# EasyEDA Pro project AS200 Mega2560电源板.eprj, board AS200Mega2560电源板-SYN-ZF
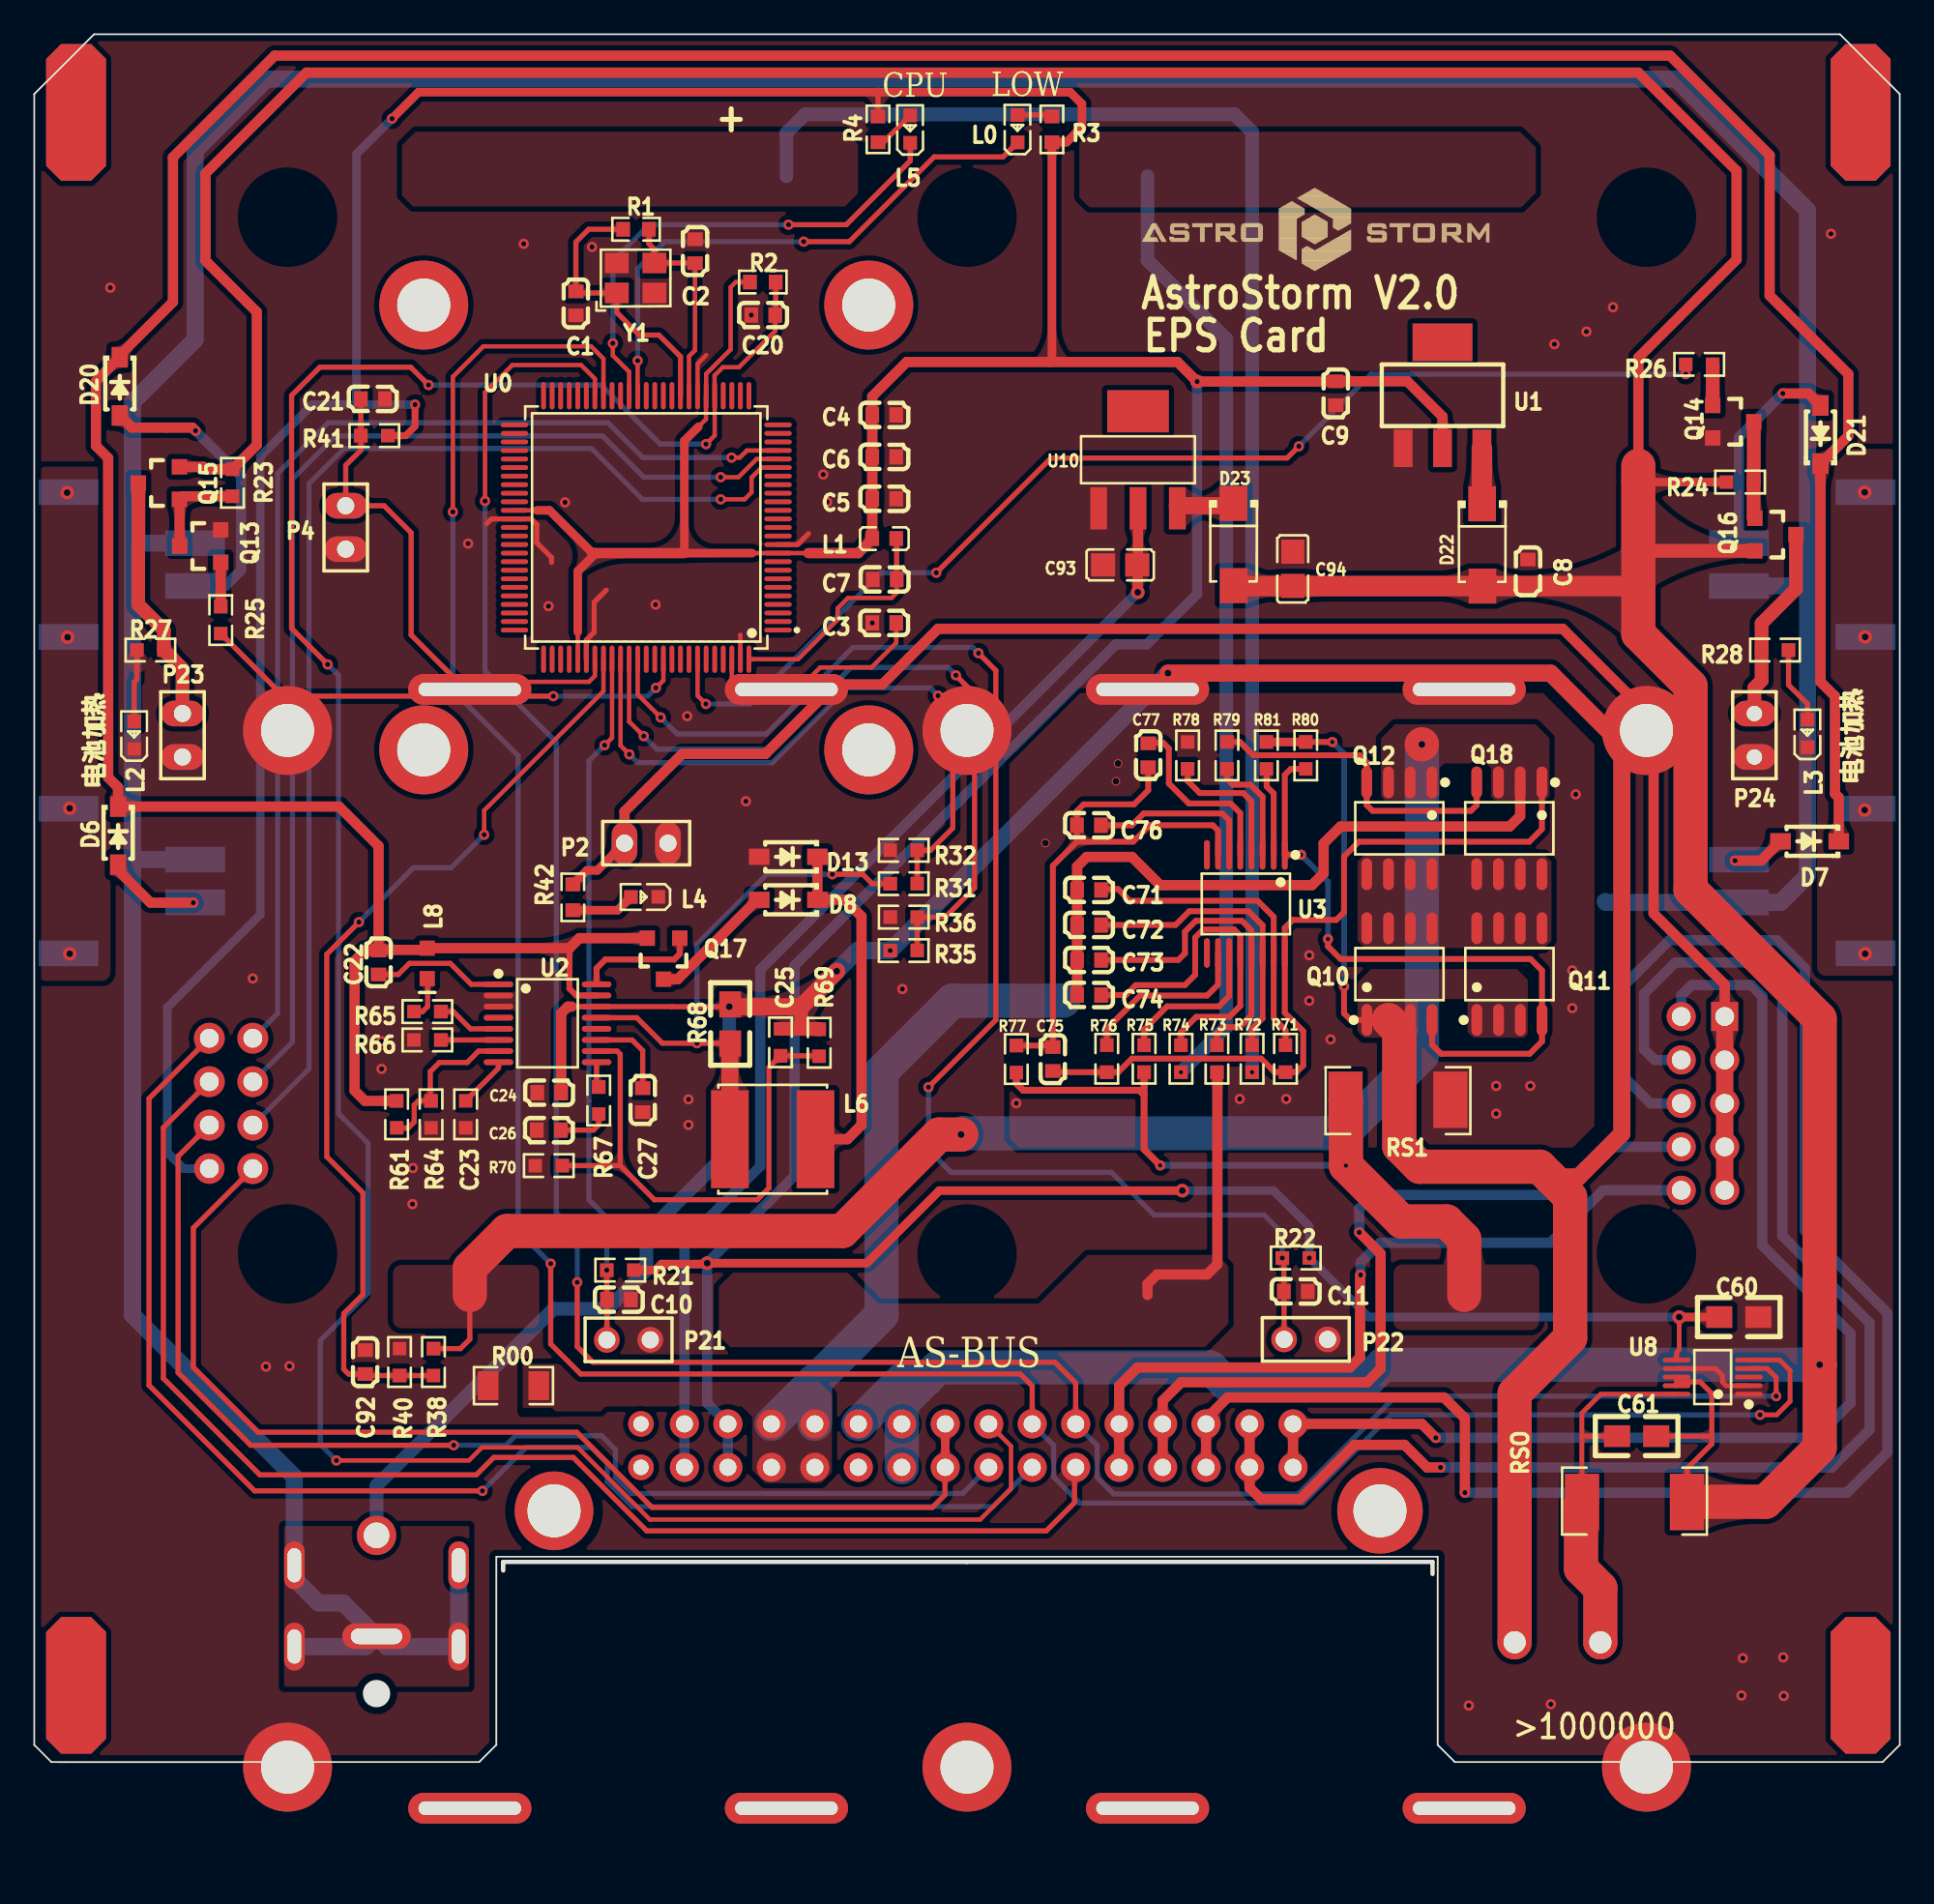
[diagram p1: board, top side]
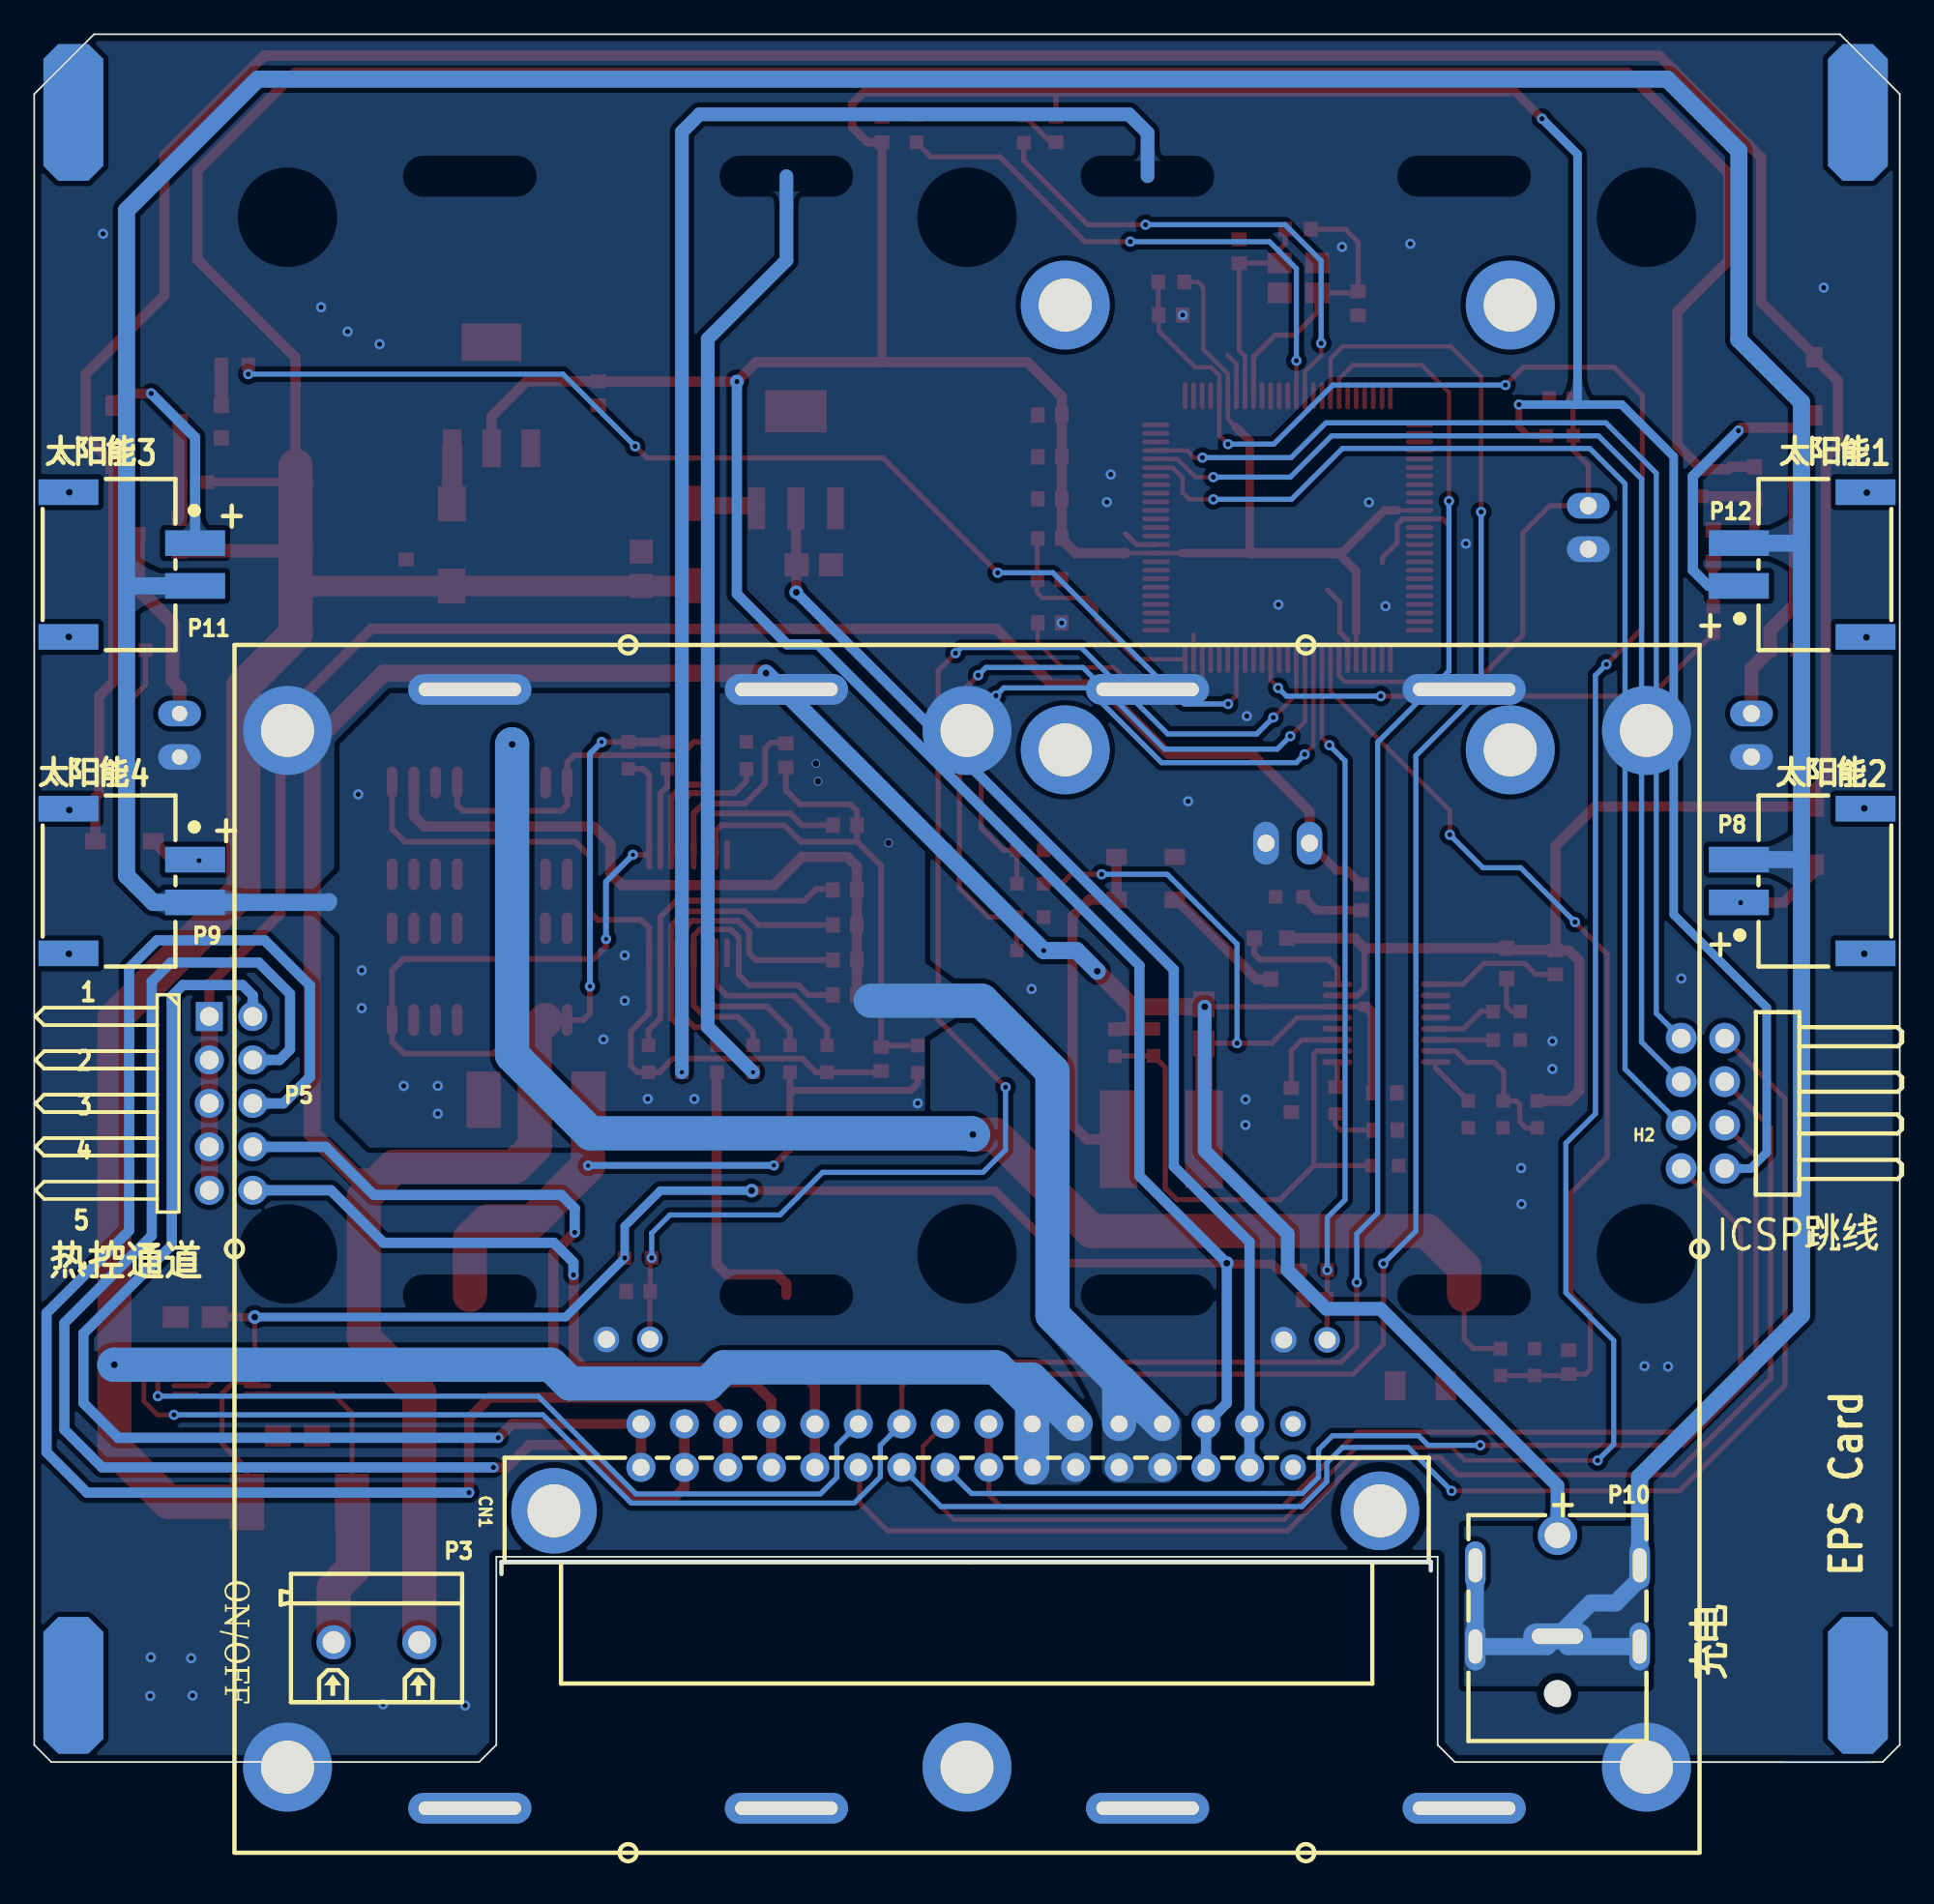
[diagram p2: board, bottom side, seen from below]

Outline 109 x 101 mm; copper layers: Top Layer, Bottom Layer. Coordinates in mm from the lower left corner of the outline.
Outline path: circle c30.35,14.71 r1.4 ; circle c78.65,14.71 r1.4 ; 0,1.01 0,97.5 3.5,101 105.5,101 109,97.5 109,1.01 108,0.01 83,0.01 82,1.01 82,12.01 27,12.01 27,1.01 26,0.01 1.85,0 1,0.01 0,1.01
Stack: Top Layer 0.0356mm / Dielectric 1 0.32mm FR-4 er 4.8 / Bottom Layer 0.0356mm

## Design rules (mm)
template: 用户自定义配置
spacing PClr1 (default): track to track 0.102, other pairs 0.102 to 0.3
track width Width (default): min 0.254, default 0.635, max 3
differential pair DiffPairsRouting (default): width min 0.381, default 0.381, max 0.381; gap min 0.254, default 0.254
via RoutingVias (default): diameter min 0.5, default 1, max 3; hole min 0.254, default 0.305, max 2.8
via viaSize1: diameter min 0.5, default 0.61, max 10; hole min 0.3, default 0.305, max 6.299

## Placement (name value [footprint] x y rotation side)
BATTERY  18650  [18650PACK]  54.5 60.01 0 bottom
C1  20pF  [C0603]  31.65 85.27 90 top
C2  20pF  [C0603]  38.61 88.32 270 top
C3  100nF  [C0603]  49.67 66.59 0 top
C4  100nF  [C0603]  49.66 78.75 180 top
C5  100nF  [C0603]  49.66 73.85 180 top
C6  100nF  [C0603]  49.66 76.3 180 top
C7  100nF  [C0603]  49.69 69.13 0 top
C8  10uF  [C0603]  87.27 69.6 270 top
C9  10uF  [C0603]  76.05 80.02 90 top
C10  10uF  [C0603]  34.16 27.03 0 top
C11  10uF  [C0603]  73.71 27.51 0 top
C20  100nF  [C0603]  42.6 84.59 0 top
C21  10uF  [C0603]  19.79 79.69 0 top
C22  100nF  [C0603]  20.12 46.74 270 top
C23  470PF  [0603]  25.21 37.08 90 top
C24  10uF  [C0603]  30.09 39.13 0 top
C25  20pf  [0603]  43.6 41.29 90 top
C26  220nF  [C0603]  30.06 36.94 180 top
C27  100nF  [C0603]  35.55 38.7 270 top
C60  100nF  [0805]  100.74 26.02 180 top
C61  100nF  [0805]  94.77 19.06 180 top
C71  100nF  [C0603]  61.64 50.98 0 top
C72  100nF  [C0603]  61.64 48.94 0 top
C73  100nF  [C0603]  61.64 46.89 0 top
C74  100nF  [C0603]  61.64 44.84 0 top
C75  2.2uF  [C0603]  59.52 41.1 90 top
C76  100nF  [C0603]  61.62 54.76 180 top
C77  100nF  [C0603]  65.09 58.85 270 top
C92  100nF  [C0603]  19.34 23.39 90 top
C93  10uf  [C0805]  63.45 69.98 0 top
C94  10uf  [C0805]  73.53 69.75 270 top
CN1  2.0-2*20P弯简牛  [CONN-TH_32P-P2.54_9001-35321C00A]  54.5 18.5 180 bottom
D6  B5819W SL  [SOD-123_L2.7-W1.6-LS3.7-RD-1]  4.9 54.16 270 top
D7  B5819W SL  [SOD-123_L2.7-W1.6-LS3.7-RD-1]  103.73 53.83 180 top
D8  B5819W SL  [SOD-123_L2.7-W1.6-LS3.7-RD-1]  44.06 50.41 180 top
D13  B5819W SL  [SOD-123_L2.7-W1.6-LS3.7-RD-1]  44.06 52.92 180 top
D20  B5819W SL  [SOD-123_L2.7-W1.6-LS3.7-RD-1]  5 80.42 270 top
D21  B5819W SL  [SOD-123_L2.7-W1.6-LS3.7-RD-1]  104.37 77.6 90 top
D22  SS54  [SMA_L4.3-W2.6-LS5.0-RD]  84.61 71.15 270 top
D23  SS54  [SMA_L4.3-W2.6-LS5.0-RD]  70.08 71.18 270 top
H2  PZ254R-12-8P  [HDR-TH_8P-P2.54-H-M-R2-C4-S2.54]  11.5 38.51 90 bottom
L0  MHT192WDT-ICE  [LED0603-RD]  57.46 95.48 90 top
L1  10uH  [L0603]  49.66 71.53 180 top
L2  NCD0603R1  [LED0603-RD_RED]  5.84 60.03 90 top
L3  NCD0603R1  [LED0603-RD_RED]  103.61 60.13 90 top
L4  NCD0603R1  [LED0603-RD_RED]  35.66 50.58 180 top
L5  NCD0603G1  [LED0603-RD]  51.18 95.46 90 top
L6  33uH  [IND-SMD_L6.0-W6.0]  43.15 36.41 180 top
L8  NCD0603R1  [LED 0603]  22.96 47.58 90 top
NOREF  -  [Pad_ie68]  106.71 4.49 180 top
NOREF#2  -  [Pad_ie73]  2.45 4.49 180 top
NOREF#3  -  [Pad_e44529]  48.76 59.17 0 top
NOREF#4  -  [Pad_ie72]  2.45 96.43 180 top
NOREF#5  -  [Pad_e44531]  48.76 85.17 0 top
NOREF#6  -  [Pad_e44527]  22.76 59.17 0 top
NOREF#7  -  [Pad_e44522]  22.76 85.17 0 top
NOREF#8  -  [Pad_ie71]  106.71 96.43 180 top
P2  加热片  [hdr1x2]  37.03 53.72 180 top
P3  WJ2EDGRC-5.08-2P  [CONN-TH_2P-P5.00_WJ301V-5.00-2P]  89 7.01 180 bottom
P4  热敏  [hdr1x2]  18.2 70.9 90 top
P5  2.54-2*5P弯针  [HDR-TH_10P-P2.54-H-M-R2-C5-S2.54-W12.9]  97.5 38.51 270 bottom
P8  S2B-PH-SM4-TB(LF)(SN)  [CONN-SMD_2P-P2.54_MEGASTAR_ZX-XH2.54-2PWT]  5.7 51.51 90 bottom
P9  S2B-PH-SM4-TB(LF)(SN)  [CONN-SMD_2P-P2.54_MEGASTAR_ZX-XH2.54-2PWT]  103.3 51.51 270 bottom
P10  WJ15EDGRC-3.81-2P  [DC-IN-TH_DC-053D-25A-1]  20 10.01 0 bottom
P11  S2B-PH-SM4-TB(LF)(SN)  [CONN-SMD_2P-P2.54_MEGASTAR_ZX-XH2.54-2PWT]  103.3 70.01 270 bottom
P12  S2B-PH-SM4-TB(LF)(SN)  [CONN-SMD_2P-P2.54_MEGASTAR_ZX-XH2.54-2PWT]  5.7 70.01 90 bottom
P21  热敏  [HDR1X2]  36 24.68 180 top
P22  热敏  [HDR1X2]  75.57 24.71 180 top
P23  加热片  [hdr1x2]  8.66 58.76 90 top
P24  加热片  [hdr1x2#2]  100.51 58.76 90 top
Q10  AO4407  [SOP-8_L4.9-W3.9-P1.27-LS6.0-BL-1]  79.77 46.06 0 top
Q11  AO4407  [SOP-8_L4.9-W3.9-P1.27-LS6.0-BL-1]  86.19 46.06 0 top
Q12  AO4407  [SOP-8_L4.9-W3.9-P1.27-LS6.0-BL-1]  79.76 54.59 180 top
Q13  S8050  [SOT23]  10.9 70.13 0 top
Q14  S8050  [SOT23]  98.07 79.3 180 top
Q15  SI2301-ZE  [SOT23]  8.48 73.82 0 top
Q16  SI2301-ZE  [SOT23]  100.53 72.71 180 top
Q17  SI2301-ZE  [SOT23]  37.72 48.16 90 top
Q18  AO4407  [SOP-8_L4.9-W3.9-P1.27-LS6.0-BL-1]  86.19 54.59 180 top
R00  0Ω  [R1206]  28 22.01 180 top
R1  1MΩ  [R0603]  35.16 89.6 0 top
R2  10kΩ  [R0603]  42.57 86.52 180 top
R3  6.8K  [R0603]  59.46 95.44 270 top
R4  6.8K  [R0603]  49.3 95.44 90 top
R21  10kΩ  [0603]  33.45 28.76 0 top
R22  10kΩ  [0603]  72.92 29.47 0 top
R23  20K  [0603]  11.58 74 90 top
R24  20K  [0603]  100.46 74.82 180 top
R25  10kΩ  [0603]  10.9 67.54 270 top
R26  10kΩ  [0603]  98.07 81.71 180 top
R27  10kΩ  [0603]  6 65.01 0 top
R28  10kΩ  [0603]  102.5 65.01 180 top
R31  30kΩ  [0603]  50.02 51.35 0 top
R32  10kΩ  [0603]  51.59 53.3 180 top
R35  30kΩ  [0603]  50.02 47.44 0 top
R36  10kΩ  [0603]  50.02 49.39 0 top
R38  30kΩ  [0603]  23.33 24.17 270 top
R40  10kΩ  [0603]  21.34 22.6 90 top
R41  10kΩ  [0603]  19.08 77.54 0 top
R42  6.8K  [R0603]  31.47 50.55 90 top
R61  33K  [0603]  21.17 38.65 270 top
R64  2.2K  [0603]  23.18 38.65 270 top
R65  10kΩ  [0603]  23.76 43.87 180 top
R66  10kΩ  [0603]  23.76 42.21 180 top
R67  120R  [0603]  32.98 39.46 270 top
R68  0.33R  [0805]  40.66 42.01 90 top
R69  90kΩ  [0603]  45.86 42.84 270 top
R70  15kΩ  [0603]  30.85 34.87 180 top
R71  1K  [0603]  73.11 40.33 90 top
R72  1K  [0603]  71.16 40.33 90 top
R73  1K  [0603]  69.1 40.33 90 top
R74  1K  [0603]  67 40.33 90 top
R75  1K  [0603]  64.85 40.33 90 top
R76  1K  [0603]  62.67 40.33 90 top
R77  51R  [0603]  57.38 41.89 270 top
R78  1K  [0603]  67.39 58.06 90 top
R79  5.1K  [0603]  69.69 58.06 90 top
R80  1M  [0603]  74.29 59.63 270 top
R81  5.1K  [0603]  71.99 59.63 270 top
RS1  0.02R  [RES-SMD_L6.4-W3.2-R2512]  79.68 38.72 180 top
RSO  10mΩ  [RES-SMD_L6.4-W3.2-R2512]  93.5 15.21 0 top
U0  ATMEGA2560-16AU  [TQFP-100_L14.0-W14.0-P0.50-LS16.0-BL]  35.76 72.17 90 top
U1  AMS1117-5.0  [SOT-223_L6.7-W3.5-P2.30-BR]  82.28 79.9 270 top
U2  CN3722  [TSSOP-16_L5.0-W4.4-P0.65-LS6.4-BL]  29.99 43.19 270 top
U3  FM8254AAV  [TSSOP-16_L5.0-W4.4-P0.65-LS6.4-BL]  70.79 50.17 180 top
U8  INA226AIDGSR  [MSOP-10_L3.0-W3.0-P0.50-LS5.0-BL]  98.07 22.51 90 top
U10  AMS1117-3.3V  [SOT-223-4_L6.5-W3.5-P2.30-LS7.0-TR]  64.49 76.13 0 top
Y1  16MHz  [OSC-SMD_4P-L3.2-W2.5-BL]  35.14 86.76 0 top

## Footprints (pads in the part's own frame, mm; a bottom-side part is the same pattern mirrored in y, then rotated)
0603
  rect 0.8x0.8 smd: 1(0,0)
  rect 0.787x0.787 smd: 2(1.575,0)
0805
  rect 1.524x1.27 smd: 1(0,0) 2(2.286,0)
18650PACK
  oval 7.2x1.8 hole 6x0.8: 1(-29.05,-2.7) 2(-10.55,-2.7) 3(10.55,-2.7) 4(29.05,-2.7) 5(-29.05,62.7) 6(-10.55,62.7) 7(10.55,62.7) 8(29.05,62.7)
  round 5.2 hole 3.1: 9(-39.7,60.3) 10(39.7,60.3) 11(0,60.3) 12(-39.7,-0.3) 13(0,-0.3) 14(39.7,-0.3)
C0603
  rect 0.8x0.9 smd: 1(-0.7,0) 2(0.7,0)
C0805
  rect 1.41x1.35 smd: 1(-1,0) 2(1,0)
CONN-SMD_2P-P2.54_MEGASTAR_ZX-XH2.54-2PWT
  rect 1.5x3.5 smd: 1(-1.25,3.7) 2(1.25,3.7) 3(-4.23,-3.7) 4(4.23,-3.7)
CONN-TH_2P-P5.00_WJ301V-5.00-2P
  round 2 hole 1.3: 1(-2.505,0) 2(2.505,0)
CONN-TH_32P-P2.54_9001-35321C00A
  round 5 hole 3.1: 1(-24.13,-3.81)
  round 4.6 hole 3.1: 1(24.13,-3.81)
  round 1.5 hole 0.9: a1(19.05,-1.27) b1(19.05,1.27)
  round 1.7 hole 1: a2(16.51,-1.27) a3(13.97,-1.27) a4(11.43,-1.27) a5(8.89,-1.27) a6(6.35,-1.27) a7(3.81,-1.27) a8(1.27,-1.27) a9(-1.27,-1.27) a10(-3.81,-1.27) a11(-6.35,-1.27) a12(-8.89,-1.27) a13(-11.43,-1.27) a14(-13.97,-1.27) a15(-16.51,-1.27) a16(-19.05,-1.27) b2(16.51,1.27) b3(13.97,1.27) b4(11.43,1.27) b5(8.89,1.27) b6(6.35,1.27) b7(3.81,1.27) b8(1.27,1.27) b9(-1.27,1.27) b10(-3.81,1.27) b11(-6.35,1.27) b12(-8.89,1.27) b13(-11.43,1.27) b14(-13.97,1.27) b15(-16.51,1.27) b16(-19.05,1.27)
DC-IN-TH_DC-053D-25A-1
  round 2.3 hole 1.5: 1(0,-3.25)
  oval 4x1.5 hole 3x0.914: 2(0,2.65)
  oval 1.2x2.8 hole 0.8x2: 3(-4.8,-1.5) 3(-4.8,3.25) 3(4.8,-1.5) 3(4.8,3.25)
hdr1x2
  oval 1.5x2.5 hole 1: 1(0,0) 2(2.54,0)
hdr1x2#2
  oval 1.5x2.5 hole 0.9: 1(0,0) 2(2.54,0)
HDR1X2
  oval 1.5x1.5 hole 1: 1(0,0) 2(2.54,0)
HDR-TH_8P-P2.54-H-M-R2-C4-S2.54
  round 1.778 hole 1.1: 1(-3.81,-1.27)
  round 1.8 hole 1.1: 2(-3.81,1.27) 3(-1.27,-1.27) 4(-1.27,1.27) 5(1.27,-1.27) 6(1.27,1.27) 7(3.81,-1.27) 8(3.81,1.27)
HDR-TH_10P-P2.54-H-M-R2-C5-S2.54-W12.9
  rect 1.7x1.575 hole 1.1: 1(-5.08,-1.27)
  round 1.7 hole 1.1: 2(-5.08,1.27) 3(-2.54,-1.27) 4(-2.54,1.27) 5(0,-1.27) 6(0,1.27) 7(2.54,-1.27) 8(2.54,1.27) 9(5.08,-1.27) 10(5.08,1.27)
IND-SMD_L6.0-W6.0
  rect 2.2x5.72 smd: 1(-2.5,0) 2(2.5,0)
L0603
  rect 0.8x0.864 smd: 1(-0.7,0) 2(0.7,0)
LED0603-RD
  rect 0.8x0.8 smd: 1(-0.799,0) 2(0.799,0)
LED0603-RD_RED
  rect 0.8x0.8 smd: 1(-0.799,-0.004) 2(0.799,0.004)
LED 0603
  rect 0.889x0.889 smd: 1(0,0) 2(-1.778,0)
MSOP-10_L3.0-W3.0-P0.50-LS5.0-BL
  oval 0.28x1.62 smd: 1(-1,-2.11) 2(-0.5,-2.11) 3(0,-2.11) 4(0.5,-2.11) 5(1,-2.11) 6(1,2.11) 7(0.5,2.11) 8(0,2.11) 9(-0.5,2.11) 10(-1,2.11)
OSC-SMD_4P-L3.2-W2.5-BL
  rect 1.4x1.2 smd: 1(-1.1,-0.875) 2(1.1,-0.875) 3(1.1,0.875) 4(-1.1,0.875)
Pad_e44522
  round 5.2 hole 3.1: 101(0,0)
Pad_e44527
  round 5.2 hole 3.1: 1(0,0)
Pad_e44529
  round 5.2 hole 3.1: 1(0,0)
Pad_e44531
  round 5.2 hole 3.1: 1(0,0)
Pad_ie68
  custom 3.5x8 hole 0.305: 1(0,0)
Pad_ie71
  custom 3.5x8 hole 0.305: 0(0,0)
Pad_ie72
  custom 3.5x8 hole 0.305: 3(0,0)
Pad_ie73
  custom 3.5x8 hole 0.305: 2(0,0)
R0603
  rect 0.806x0.864 smd: 1(-0.753,0) 2(0.753,0)
R1206
  rect 1.208x1.701 smd: 1(-1.479,0) 2(1.479,0)
RES-SMD_L6.4-W3.2-R2512
  rect 2x3.3 smd: 1(-3.067,0) 2(3.067,0)
SMA_L4.3-W2.6-LS5.0-RD
  rect 2.046x1.62 smd: 1(-2.404,-0.009) 2(2.404,0.009)
SOD-123_L2.7-W1.6-LS3.7-RD-1
  rect 1.2x0.95 smd: 1(-1.7,0) 2(1.7,0)
SOP-8_L4.9-W3.9-P1.27-LS6.0-BL-1
  oval 0.63x1.865 smd: 1(-1.905,-2.683) 2(-0.635,-2.683) 3(0.635,-2.683) 4(1.905,-2.683) 5(1.905,2.683) 6(0.635,2.683) 7(-0.635,2.683) 8(-1.905,2.683)
SOT23
  rect 0.9x0.9 smd: 1(0,0) 2(0,1.9) 3(-2.4,0.95)
SOT-223-4_L6.5-W3.5-P2.30-LS7.0-TR
  rect 0.98x2.47 smd: 1(-2.3,-2.835) 2(0,-2.835) 3(2.3,-2.835)
  rect 3.6x2.47 smd: 4(0,2.835)
SOT-223_L6.7-W3.5-P2.30-BR
  rect 2.2x1.1 smd: 1(3.099,-2.3) 2(3.099,0) 3(3.099,2.3)
  rect 2.2x3.5 smd: 4(-3.099,0)
TQFP-100_L14.0-W14.0-P0.50-LS16.0-BL
  oval 0.28x1.6 smd: 1(-6,-7.7) 2(-5.5,-7.7) 3(-5,-7.7) 4(-4.5,-7.7) 5(-4,-7.7) 6(-3.5,-7.7) 7(-3,-7.7) 8(-2.5,-7.7) 9(-2,-7.7) 10(-1.5,-7.7) 11(-1,-7.7) 12(-0.5,-7.7) 13(0,-7.7) 14(0.5,-7.7) 15(1,-7.7) 16(1.5,-7.7) 17(2,-7.7) 18(2.5,-7.7) 19(3,-7.7) 20(3.5,-7.7) 21(4,-7.7) 22(4.5,-7.7) 23(5,-7.7) 24(5.5,-7.7) 25(6,-7.7) 51(6,7.7) 52(5.5,7.7) 53(5,7.7) 54(4.5,7.7) 55(4,7.7) 56(3.5,7.7) 57(3,7.7) 58(2.5,7.7) 59(2,7.7) 60(1.5,7.7) 61(1,7.7) 62(0.5,7.7) 63(0,7.7) 64(-0.5,7.7) 65(-1,7.7) 66(-1.5,7.7) 67(-2,7.7) 68(-2.5,7.7) 69(-3,7.7) 70(-3.5,7.7) 71(-4,7.7) 72(-4.5,7.7) 73(-5,7.7) 74(-5.5,7.7) 75(-6,7.7)
  oval 1.6x0.28 smd: 26(7.7,-6) 27(7.7,-5.5) 28(7.7,-5) 29(7.7,-4.5) 30(7.7,-4) 31(7.7,-3.5) 32(7.7,-3) 33(7.7,-2.5) 34(7.7,-2) 35(7.7,-1.5) 36(7.7,-1) 37(7.7,-0.5) 38(7.7,0) 39(7.7,0.5) 40(7.7,1) 41(7.7,1.5) 42(7.7,2) 43(7.7,2.5) 44(7.7,3) 45(7.7,3.5) 46(7.7,4) 47(7.7,4.5) 48(7.7,5) 49(7.7,5.5) 50(7.7,6) 76(-7.7,6) 77(-7.7,5.5) 78(-7.7,5) 79(-7.7,4.5) 80(-7.7,4) 81(-7.7,3.5) 82(-7.7,3) 83(-7.7,2.5) 84(-7.7,2) 85(-7.7,1.5) 86(-7.7,1) 87(-7.7,0.5) 88(-7.7,0) 89(-7.7,-0.5) 90(-7.7,-1) 91(-7.7,-1.5) 92(-7.7,-2) 93(-7.7,-2.5) 94(-7.7,-3) 95(-7.7,-3.5) 96(-7.7,-4) 97(-7.7,-4.5) 98(-7.7,-5) 99(-7.7,-5.5) 100(-7.7,-6)
TSSOP-16_L5.0-W4.4-P0.65-LS6.4-BL
  oval 0.343x1.732 smd: 1(-2.275,-2.866) 2(-1.625,-2.866) 3(-0.975,-2.866) 4(-0.325,-2.866) 5(0.325,-2.866) 6(0.975,-2.866) 7(1.625,-2.866) 8(2.275,-2.866) 9(2.275,2.866) 10(1.625,2.866) 11(0.975,2.866) 12(0.325,2.866) 13(-0.325,2.866) 14(-0.975,2.866) 15(-1.625,2.866) 16(-2.275,2.866)

## Nets
3V3BUS: C93.2 CN1.a2 CN1.b2 U10.2
+5V: C4.2 C5.2 C6.2 C9.2 C60.2 CN1.a3 CN1.b3 H2.1 L1.2 R2.2 R3.2 R4.2 R21.2 R22.2 R41.2 U0.10 U0.31 U0.61 U0.80 U1.2 U8.6
AGND: CN1.a4 CN1.a5 CN1.b4 CN1.b5 P8.2 P9.2 P10.2 P10.3 P11.2 P12.2 R00.1 R78.2 RS1.1
V12V: C8.2 C61.1 C94.2 CN1.a6 CN1.a7 CN1.b6 CN1.b7 D22.2 D23.2 Q15.2 Q16.2 R23.2 R24.2 RSO.2 U8.8 U8.9
VIN+: C61.2 P3.1 RSO.1 U8.10
89UASDIF: D23.1 U10.3
ADC8: U0.89
ADC9: U0.88
ADC10: C11.1 P22.2 R22.1 U0.87
ADC11: R35.2 R36.2 U0.86
ADC12: R31.2 R32.1 U0.85
ADC13: C10.1 P21.2 R21.1 U0.84
ADC14: C92.1 R38.2 R40.1 U0.83
ADC15: C21.1 P4.2 R41.1 U0.82
AREF: C3.2 U0.98
B1: BATTERY.3 BATTERY.4 R74.1
B2: BATTERY.6 BATTERY.7 R73.1
B3: BATTERY.1 BATTERY.2 R72.1
B+: BATTERY.5 C71.1 C72.1 C73.1 C74.1 C75.1 Q12.1 Q12.2 Q12.3 Q18.1 Q18.2 Q18.3 R38.1 R71.1 R76.1 U3.16
B-: BATTERY.8 R75.1 R77.2 RS1.2
ICSP5V: CN1.a8 CN1.b8 H2.2
LEDB: L5.1 U0.40
LEDR: L0.1 U0.39
N1: P8.3 P8.4 P12.3 P12.4
N2: P9.3 P9.4 P11.3 P11.4
NETC7_2: C7.2 L1.1 U0.100
NETC22_2: C22.2 U2.1
NETC23_2: C23.2 U2.8
NETC25_1: C25.1 R69.2 R70.1 U2.10
NETC26_1: C26.1 R67.2
NETC27_1: C27.1 U2.11
NETC75_2: C75.2 C76.2 C77.2 R77.1 U3.7
NETC76_1: C76.1 U3.6
NETC77_1: C77.1 U3.5
NETD6_2: D6.2 P8.1
NETD7_2: D7.2 P9.1
NETD8_1: D8.1 D13.1 L6.1
NETD8_2: D8.2 Q17.3
NETD20_2: D20.2 P12.1
NETD21_2: D21.2 P11.1
NETL0_1: L0.2 R3.1
NETL2_1: L2.2 R27.1
NETL3_1: L3.2 R28.1
NETL4_1: L4.2 R42.1
NETL5_1: L5.2 R4.1
NETL8_2: L8.2 R65.2
NETP2_2: P2.2 P5.1 P5.3 P5.5 P5.7 P5.9 R42.2
NETP23_2: P23.2 Q15.3 R27.2
NETP24_2: P24.2 Q16.3 R28.2
NETQ10_4: Q10.4 Q11.4 R80.2 U3.1
NETQ10_5: Q10.5 Q10.6 Q10.7 Q10.8 Q11.5 Q11.6 Q11.7 Q11.8 Q12.5 Q12.6 Q12.7 Q12.8 Q18.5 Q18.6 Q18.7 Q18.8
NETQ12_4: Q12.4 Q18.4 R79.2
NETQ13_1: Q13.1 R25.1
NETQ13_3: Q13.3 Q15.1 R23.1
NETQ14_1: Q14.1 R26.1
NETQ14_3: Q14.3 Q16.1 R24.1
NETQ17_1: Q17.1 U2.16
NETR61_2: R61.2 R64.1 U2.7
NETR65_1: R65.1 U2.5
NETR66_1: R66.1 U2.6
NETR67_1: R67.1 U2.9
NETR75_2: R75.2 U3.11
NETR76_2: R76.2 U3.10
NETR78_1: R78.1 U3.4
NETR79_1: R79.1 U3.3
NETR81_2: R81.2 U3.2
P+: C24.2 C25.2 P3.2 P10.1 Q10.1 Q10.2 Q10.3 Q11.1 Q11.2 Q11.3 R35.1 R68.2 R69.1 R80.1 R81.1 U2.14
P-: C1.1 C2.1 C3.1 C4.1 C5.1 C6.1 C7.1 C8.1 C9.1 C10.2 C11.2 C20.1 C21.2 C23.1 C24.1 C26.2 C27.2 C60.1 C92.2 C93.1 C94.1 D13.2 L2.1 L3.1 L4.1 P2.1 P4.1 P21.1 P22.1 P23.1 P24.1 Q13.2 Q14.2 R00.2 R32.2 R36.1 R40.2 R64.2 R66.2 R70.2 U0.11 U0.32 U0.62 U0.81 U0.99 U1.1 U2.2 U2.3 U8.1 U8.2 U8.7 U10.1 Y1.2 Y1.4
PB1: H2.4 U0.20
PB1PC: CN1.a9 H2.3
PB2: H2.6 U0.21
PB2PC: CN1.a11 H2.5
PB3: H2.8 U0.22
PB3PC: CN1.a10 H2.7
RESET: C20.2 CN1.b9 R2.1 U0.30
RX: U0.2
SCL: CN1.b10 U0.43 U8.5
SDA: CN1.b11 U0.44 U8.4
SUN1: L6.2 R31.1 R68.1 U2.13
SW0: R25.2 U0.90
SW1: U0.91
SW2: U0.92
SW3: U0.93
SW4: R26.2 U0.94
SW5: U0.95
SW6: U0.96
SW7: U0.97
TX: U0.3
U1_3: D22.1 U1.3
VC1: C71.2 R71.2 U3.15
VC2: C72.2 R72.2 U3.14
VC3: C73.2 R73.2 U3.13
VC4: C74.2 R74.2 U3.12
VSOLAR: C22.1 D6.1 D7.1 D20.1 D21.1 L8.1 Q17.2 R61.1 U2.15
VT0: CN1.a16 CN1.b16 P5.2
VT1: CN1.a15 CN1.b15 P5.4
VT2: CN1.a14 CN1.b14 P5.6
VT3: CN1.a13 CN1.b13 P5.8
VT4: CN1.a12 CN1.b12 P5.10
XTAL1: C1.2 R1.1 U0.34 Y1.1
XTAL2: C2.2 R1.2 U0.33 Y1.3

Pads without a net: BATTERY 9 10 11 12 13 14; CN1 1 a1 b1; NOREF 1; NOREF#2 2; NOREF#3 1; NOREF#4 3; NOREF#5 1; NOREF#6 1; NOREF#7 101; NOREF#8 0; U0 1 4 5 6 7 8 9 12 13 14 15 16 17 18 19 23 24 25 26 27 28 29 35 36 37 38 41 42 45 46 47 48 49 50 51 52 53 54 55 56 57 58 59 60 63 64 65 66 67 68 69 70 71 72 73 74 75 76 77 78 79; U1 4; U2 4 12; U3 8 9; U8 3; U10 4

## Via types
v1: diameter 2, hole 0.4, Top Layer to Bottom Layer, 3 vias
v2: diameter 0.5, hole 0.254, Top Layer to Bottom Layer, 2 vias
v3: diameter 0.6, hole 0.254, Top Layer to Bottom Layer, 6 vias
v4: diameter 0.6, hole 0.3, Top Layer to Bottom Layer, 96 vias
v5: diameter 0.8, hole 0.4, Top Layer to Bottom Layer, 15 vias
v6: diameter 0.5, hole 0.3, Top Layer to Bottom Layer, 1 via
v7: diameter 0.8, hole 0.3, Top Layer to Bottom Layer, 1 via
v8: diameter 0.5, hole 0.4, Top Layer to Bottom Layer, 3 vias

## Routing (per net, layer and track width the routed paths; a pad name or vN(x,y) marks a point on that pad's centre or on a via; arc(x,y) is an arc through that point)
3V3BUS: length 66.5
  Top Layer w0.6: 64.49,72.71 64.49,69.95 64.48,69.93 v5(64.48,68.38)
  Bottom Layer w0.6: CN1.a2 CN1.b2 37.99,30.4 42.42,34.83 42.42,46.32 v5(64.48,68.38)
+5V: length 377.2
  Top Layer w0.254: 38.8,78.05 39.25,78.5 39.25,79.86 U0.31 39.26,81.15 40.69,82.58 40.69,86.22 40.99,86.52 R2.2 ; 41.94,70.67 U0.10 45.23,70.67 ; U0.61 29.37,73.17 ; U0.80 31.76,66.07
  Top Layer w0.28: U8.6 95.96,23.95 96.11,24.1 v5(96.11,26.02)
  Top Layer w0.3: 49.3,97.62 49.3,97.62 R4.2
  Top Layer w0.4: R41.2 21.7,77.54 22.25,78.09 v4(22.25,79.36)
  Top Layer w0.5: v4(20.9,96.07) 22.45,97.62 60.53,97.62 61.21,96.93 61.21,95.59 60.32,94.69 R3.2 59.46,81.96 59.35,81.84 ; 32.61,70.67 30.11,73.17 29.37,73.17 ; 31.76,66.07 31.76,69.61 32.79,70.65 ; 41.94,70.67 37.98,70.67 37.98,77.24 38.8,78.05 ; v5(67.08,33.41) 52.88,33.41 48.64,29.17 v5(39.32,29.17) 39.27,29.11 36.65,29.11 36.3,28.76 R21.2 ; 32.77,70.67 32.82,70.67 ; v5(96.11,26.02) C60.2
  Top Layer w0.6: 32.61,70.67 32.77,70.67 32.79,70.65 ; 32.82,70.67 37.98,70.67 ; U1.2 82.28,78.66 80.22,80.72 C9.2 76.03,80.7 v7(67.94,80.7) 66.8,81.84 50.98,81.84 48.97,79.83 48.97,71.5 48.14,70.67 45.23,70.67
  Bottom Layer w0.5: v5(96.11,26.02) 77.95,26.02 v6(74.5,29.47) 74.5,31.32 72.42,33.41 v5(67.08,33.41) ; v4(20.9,96.07) 18.83,93.99 18.83,79.38 18.86,79.36 ; 18.86,79.36 v4(22.25,79.36) ; 18.86,79.36 16.25,79.36 13.21,76.31 13.21,49.55 7.77,44.11 7.77,35.64 8.72,34.7 H2.1
  Bottom Layer w0.6: CN1.a3 CN1.b3 39.32,20.98 v5(39.32,29.17) 44.43,34.27 44.43,46.56 63.2,65.34 65,65.34 67.94,68.28 v7(67.94,80.7)
AGND: length 309.9
  Bottom Layer w1: P10.2 19.4,6.75 P10.3 ; P10.2 20.6,6.75 P10.3 P10.3 ; P10.2 18.05,9.31 16.6,9.31 15.2,10.71 15.2,16.67 5.74,26.13 5.74,52.74 ; 103.61,68.74 103.59,68.75 P11.2 ; 103.61,68.74 103.61,90.71 95.94,98.38 13.59,98.38 9.4,94.19 9.4,83.15 5.74,79.49 5.74,71.28 ; 103.61,68.74 103.61,51.82 102.04,50.25 P9.2 91.84,50.25 91.79,50.3 ; P8.2 5.75,52.76 5.74,52.74 ; 5.74,71.28 5.74,52.74 ; 5.74,71.28 5.77,71.26 P12.2
  Bottom Layer w2: 60.13,44.51 53.65,44.51 49.5,40.37 49.5,26.14 45.61,22.25 ; 45.61,22.25 CN1.b5 ; 45.61,22.25 45.55,22.25 CN1.b4
  vias: v4(57.38,38.51) v4(70.43,38.77) v4(73.15,38.77) v4(74.5,47.16) v4(74.5,44.51) v4(75.74,42.25) v4(85.42,39.53) v4(85.42,37.9) v4(87.41,39.53) v4(89.87,46.28) v4(89.87,44.07) v4(90.07,56.57) v8(59.08,53.73) v8(63.2,57.33) v8(63.33,58.38)
V12V: length 319.9
  Top Layer w0.3: 98.02,18.98 98.02,18.61 96.57,17.16 RSO.2 ; 98.02,18.98 97.94,19.06 C61.1 ; 98.02,18.98 98.02,21.54 97.34,22.22 95.96,22.22 ; U8.8 95.96,22.22 ; 95.96,22.22 U8.9
  Top Layer w0.5: 93.73,74.86 93.76,74.82 R24.2
  Top Layer w0.6: Q15.2 9.89,75.72 10.03,75.57 R23.2 13,76.99 13,84.77 10.01,87.76 10.01,92.87 15.9,98.76 93.73,98.76 99.47,93.02 99.47,87.84 93.73,82.1 93.73,75.78
  Top Layer w0.8: Q16.2 93.8,70.81 93.73,70.88
  Top Layer w1.2: 93.73,68.78 93.69,68.75 D22.2 70.11,68.75 D23.2
  Top Layer w2: RSO.2 96.58,15.22 101.17,15.22 104.32,18.37 v1(104.32,23.23) 104.32,43.46 96.77,51.01 96.77,62.9 93.73,65.95 93.73,75.78
  Bottom Layer w2: 52.09,22.37 50.75,22.37 CN1.b6 ; 52.09,22.37 50.69,20.96 CN1.b7 CN1.a7 ; 52.09,22.37 52.81,23.08 68.7,23.08 69.65,22.13 77.7,22.13 78.8,23.23 v1(104.32,23.23)
VIN+: length 22
  Top Layer w0.28: RSO.1 90.43,17.14 90.42,17.15 90.42,19.02 ; C61.2 90.46,19.06 90.42,19.02 ; 90.42,19.02 90.42,20.4 91.53,21.51 U8.10
  Top Layer w2: RSO.1 90.37,15.15 90.37,11.31 91.5,10.18 P3.1
89UASDIF: length 3.3
  Top Layer w1: 66.79,73.45 69.94,73.45 D23.1
ADC10: length 85.2
  Top Layer w0.254: U0.87 35.26,62.41 v4(36.6,61.07)
  Top Layer w0.3: P22.2 73.03,27.5 C11.1 73.01,29.38 v4(72.92,29.47) ; v4(55.17,64.83) 56.19,63.81 56.19,43.39 v4(52.25,39.45)
  Bottom Layer w0.3: v4(52.25,39.45) 52.25,35.79 53.57,34.47 62.94,34.47 65.43,31.98 71.86,31.98 72.92,30.92 v4(72.92,29.47) ; v4(55.17,64.83) 54.84,65.16 47.83,65.16 42.77,60.1 37.57,60.1 v4(36.6,61.07)
ADC11: length 44.5
  Top Layer w0.254: U0.86 34.76,60.83 v4(35.61,59.97)
  Top Layer w0.3: R35.2 R36.2 53.23,49.39 54.94,51.11 54.94,62.44 v4(53.85,63.53)
  Bottom Layer w0.3: v4(53.85,63.53) 53.39,63.99 47.73,63.99 42.95,59.21 36.37,59.21 v4(35.61,59.97)
ADC12: length 38.7
  Top Layer w0.254: v4(34.77,58.91) 34.26,59.42 U0.85
  Top Layer w0.3: R31.2 R32.1 52.37,53.3 53.67,54.6 53.67,61.47 v4(52.81,62.34)
  Bottom Layer w0.3: v4(52.81,62.34) 52.35,62.79 47.5,62.79 43.13,58.43 35.26,58.43 v4(34.77,58.91)
ADC13: length 40.8
  Top Layer w0.254: v4(33.33,59.44) 33.76,59.88 U0.84
  Top Layer w0.3: P21.2 33.46,24.69 33.46,27.26 33.45,27.27 v4(33.45,28.76)
  Bottom Layer w0.3: v4(33.45,28.76) 33.45,31.83 32.41,32.87 32.41,58.53 v4(33.33,59.44)
ADC14: length 56.2
  Top Layer w0.254: v4(26.29,54.21) 26.29,55.63 33.26,62.6 U0.83
  Top Layer w0.3: v4(18.97,49.1) 17.09,47.22 17.09,35.39 19.2,33.28 19.2,27.34 18.09,26.22 18.09,22.97 18.37,22.69 C92.1 19.43,22.6 R40.1 R38.2
  Bottom Layer w0.3: v4(26.29,54.21) 24.36,52.28 22.15,52.28 v4(18.97,49.1)
ADC15: length 30
  Top Layer w0.254: U0.82 32.76,63.5 32.41,63.15 26.39,63.15
  Top Layer w0.3: C21.1 19.09,77.54 R41.1 19.08,76.69 18.2,75.81 P4.2 20.44,73.44 22.02,71.86 22.02,65.89 24.77,63.15 26.39,63.15
AREF: length 13.2
  Top Layer w0.254: C3.2 50.37,65.43 48.92,63.99 45.92,63.99 44.73,62.79 41.35,62.79 40.76,63.39 U0.98
B1: length 55.4
  Bottom Layer w0.8: v2(67,40.33) 69.65,42.98 69.65,83.19 65.05,87.79 65.05,92.71
B2: length 16.4
  Top Layer w0.6: 65.05,27.31 65.05,27.95 65.61,28.5 68.53,28.5 69.13,29.11 69.13,40.3 R73.1
B3: length 85.6
  Bottom Layer w0.8: 43.95,92.71 43.95,95.24 45.03,96.32 70.13,96.32 71.16,95.29 v2(71.16,40.33)
B+: length 170.6
  Top Layer w0.3: R38.1 24.9,24.17 25.45,24.72 25.45,27.31
  Top Layer w0.34: C75.1 59.59,40.33 R76.1 63.34,40.33 64.13,41.13 71.68,41.13 72.48,40.33 R71.1 73.75,40.33 74.14,40.72 74.14,42.73 73.07,43.8 73.07,48.77 73.53,49.23 76.07,49.23 76.53,49.69 76.53,52.94 77.39,53.8 87.35,53.8 88.09,54.54 88.09,57.27
  Top Layer w0.6: C71.1 60.86,50.91 ; C71.1 C72.1 C73.1 C74.1 ; C71.1 60.94,52.36 61.49,52.91 64.13,52.91 65.79,51.26 74.65,51.26 75.34,51.95 75.34,53.7 76.33,54.69 86.21,54.69 86.82,55.3 86.82,57.27
  Top Layer w2: v1(54.15,36.68) 52.86,36.68 47.22,31.04 27.62,31.04 25.45,28.88 25.45,27.31
  Bottom Layer w2: v1(81.08,59.49) 81.08,41.33 76.5,36.76 54.23,36.76 v1(54.15,36.68)
B-: length 40.9
  Top Layer w0.4: 57.38,40.31 57.38,39.67 57.78,39.27 64.57,39.27 64.85,38.99 ; R75.1 64.85,38.99 ; 64.85,38.99 64.85,35.82 v3(65.79,34.88)
  Top Layer w2: 83.55,27.31 83.55,30.58 82.53,31.6 79.9,31.6 v3(76.64,34.87) 76.64,38.69 RS1.2
  Bottom Layer w0.4: v3(76.64,34.87) 76.62,34.88 v3(65.79,34.88)
ICSP5V: length 64.8
  Top Layer w0.3: CN1.a8 53.21,17.21 53.21,15.63 52.48,14.89 36.09,14.89 31.7,19.28 13.08,19.28 9.3,23.07 9.3,31.22 H2.2
  Top Layer w0.5: CN1.b8 CN1.a8
LEDB: length 29.1
  Top Layer w0.254: v4(33.81,82.94) 33.81,82.23 34.76,81.27 U0.40
  Top Layer w0.3: v4(44.07,89.87) 47.45,89.87 51.18,93.61 51.18,94.66
  Bottom Layer w0.3: v4(44.07,89.87) 35.92,89.87 33.81,87.76 v4(33.81,82.94)
LEDR: length 32.7
  Top Layer w0.254: U0.39 35.26,79.88 v4(35.26,81.92)
  Top Layer w0.3: L0.1 56.6,93.83 52.58,93.83 47.62,88.88 v4(44.96,88.88)
  Bottom Layer w0.3: v4(44.96,88.88) 36.83,88.88 35.26,87.31 v4(35.26,81.92)
N1:
  vias: v5(1.92,74.21) v5(1.95,65.75) v5(2.07,55.75) v5(2.07,47.25)
N2:
  vias: v5(106.95,74.23) v5(106.98,65.77) v5(106.95,55.65) v5(106.98,47.25)
NETC7_2: length 13.8
  Top Layer w0.254: U0.100 44.63,64.47 46.94,66.78 46.94,67.44 47.55,68.05 50.09,68.05 50.39,68.35 C7.2
  Top Layer w0.3: C7.2 50.39,71.5 L1.1
NETC22_2: length 7.8
  Top Layer w0.3: U2.1 25.53,45.46 24.31,46.69 21.92,46.69 21.27,46.04 C22.2
NETC23_2: length 3.1
  Top Layer w0.3: C23.2 27.12,40.57 U2.8
NETC25_1: length 31.4
  Top Layer w0.3: 34.24,34.87 34.24,41.38 34.06,41.56 U2.10 ; 34.24,34.87 R70.1 ; 34.24,34.87 36.23,32.87 42.24,32.87 42.93,33.56 42.93,40.61 C25.1 45.84,41.29 R69.2
NETC26_1: length 3
  Top Layer w0.3: C26.1 32.67,36.94 32.98,37.26 R67.2
NETC27_1: length 5.1
  Top Layer w0.3: C27.1 35.55,41.59 34.93,42.21 U2.11
NETC75_2: length 32.8
  Top Layer w0.34: 60.92,53.8 C76.2 60.92,55.59 61.32,55.99 64.26,55.99 65.09,56.81 C77.2 ; 60.92,53.8 64.21,53.8 65.18,54.77 68.86,54.77 69.17,54.46 U3.7 ; 60.92,53.8 59.52,52.39 C75.2 59.43,41.89 R77.1
NETC76_1: length 10
  Top Layer w0.34: C76.1 64.13,54.76 64.82,55.45 69.42,55.45 69.82,55.05 U3.6
NETC77_1: length 10.7
  Top Layer w0.34: U3.5 70.47,55.47 69.9,56.04 67.46,56.04 66.29,57.21 66.29,59.25 65.95,59.59 65.13,59.59 C77.1
NETD6_2: length 5.5
  Top Layer w0.6: v4(9.3,50.24) 6.79,50.24 4.9,52.13 D6.2
NETD7_2: length 3.1
  Top Layer w0.6: D7.2 100.9,52.69 v4(99.37,52.69)
NETD8_1: length 21.4
  Top Layer w0.6: 45.65,35.75 L6.1 47.51,36.41 48.34,37.24 48.34,49.43 47.36,50.41 D8.1 D13.1
NETD8_2: length 7.5
  Top Layer w0.6: D8.2 42.24,50.41 37.59,45.76 Q17.3
NETD20_2: length 17.1
  Top Layer w0.6: D20.2 5.71,78.01 9.24,78.01 v4(9.42,77.83)
  Bottom Layer w0.6: P12.1 11.17,68.75 12.09,69.68 12.09,75.16 v4(9.42,77.83)
NETD21_2: length 12.3
  Top Layer w0.6: v4(102.17,80.01) 103.67,80.01 D21.2
  Bottom Layer w0.6: P11.1 99.6,77.44 v4(102.17,80.01)
NETL0_1: length 2
  Top Layer w0.3: L0.2 59.38,96.28 R3.1
NETL2_1: length 4.2
  Top Layer w0.3: L2.2 5.84,63.12 5.99,63.28 5.99,64.3 6,64.31 R27.1
NETL3_1: length 4.5
  Top Layer w0.3: R28.1 102.5,62.97 103.6,61.86 L3.2
NETL4_1: length 3.7
  Top Layer w0.5: R42.1 34.09,49.8 L4.2
NETL5_1: length 2.5
  Top Layer w0.3: R4.1 49.61,94.69 51.18,96.26
NETL8_2: length 2.6
  Top Layer w0.3: 22.18,43.87 22.69,43.87 22.99,44.17 22.99,45.78 23.03,45.82
NETP2_2: length 101.3
  Top Layer w0.5: 34.49,54.72 34.2,54.42 ; P2.2 32.9,52.13 32.29,52.13 R42.2
  Top Layer w0.6: P5.1 98.77,45.46 94.62,49.61 94.62,60.94 89.31,66.25 52.81,66.25 49.56,63 46.79,63 42.72,58.93 37.86,58.93 34.49,55.56 34.49,54.72
  Top Layer w1: P5.1 P5.3 P5.5 P5.9
NETP23_2: length 14.5
  Top Layer w0.8: Q15.3 6.08,71.01 6.08,71.01 6.08,67.67 7.58,66.17 R27.2 8.66,63.92 P23.2
NETP24_2: length 11.5
  Top Layer w0.8: P24.2 100.51,62.8 100.93,63.22 100.93,66.56 102.93,68.57 Q16.3
NETQ10_4: length 38.6
  Top Layer w0.34: v3(75.59,48.11) 75.59,47.68 76.33,46.94 87.43,46.94 88.1,46.27 Q11.4 88.1,42.13 87.38,41.41 82.19,41.41 81.67,41.93 Q10.4 ; v3(74.02,53.04) 73.08,53.04 U3.1 73.07,57.71 73.42,58.06 74.29,58.06
  Bottom Layer w0.34: v3(74.02,53.04) 75.59,51.47 v3(75.59,48.11)
NETQ12_4: length 19.2
  Top Layer w0.34: R79.2 70.45,59.63 71.22,58.86 77.44,58.86 77.85,58.45 77.85,55.95 78.19,55.61 83.94,55.61 84.28,55.95 84.28,57.27
NETQ13_1: length 2.6
  Top Layer w0.6: Q13.1 R25.1
NETQ13_3: length 5.9
  Top Layer w0.6: R23.1 8.66,74 Q15.1 8.5,73.8 Q13.3
NETQ14_1: length 2.4
  Top Layer w0.8: Q14.1 R26.1
NETQ14_3: length 5.7
  Top Layer w0.8: Q16.1 100.46,72.78 R24.1 100.47,74.84 Q14.3
NETQ17_1: length 7.1
  Top Layer w0.35: Q17.1 37.72,47.25 37.39,46.92 33.38,46.92 32.86,46.4 U2.16
NETR61_2: length 9.5
  Top Layer w0.3: R61.2 21.19,37.06 21.84,37.06 22.2,37.42 22.2,38.41 22.44,38.65 R64.1 23.14,38.7 23.14,40.37 23.67,40.9 25.3,40.9 25.96,41.56 U2.7
NETR65_1: length 3.8
  Top Layer w0.3: R65.1 24.48,43.87 25.49,42.86 U2.5
NETR66_1: length 3.4
  Top Layer w0.3: R66.1 U2.6
NETR67_1: length 1.5
  Top Layer w0.3: R67.1 32.86,39.59 U2.9
NETR75_2: length 9.2
  Top Layer w0.34: R75.2 64.85,42.83 66.19,44.18 69.22,44.18 69.82,44.78 69.82,47.3
NETR76_2: length 10.4
  Top Layer w0.34: 69.17,47.3 69.17,45.45 68.53,44.81 64.62,44.81 62.67,42.86 R76.2
NETR78_1: length 8.1
  Top Layer w0.34: U3.4 71.12,56.17 70.64,56.65 68.1,56.65 67.39,57.36 R78.1
NETR79_1: length 6.5
  Top Layer w0.34: R79.1 69.69,57.48 70.03,57.14 71.06,57.14 71.77,56.43 U3.3
NETR81_2: length 5.2
  Top Layer w0.34: U3.2 72.42,56.62 72.01,57.03 72.01,58.04 71.99,58.06
P+: length 217.1
  Top Layer w0.3: v5(40.61,44.16) 37.25,44.16 37.25,44.16 U2.14 31.41,44.16
  Top Layer w0.34: v3(76.53,45.34) 76.53,43.77 76.92,43.38 Q10.1 ; v3(75.84,59.63) R80.1
  Top Layer w0.5: R81.1 R80.1
  Top Layer w0.6: C24.2 30.79,43.77 31.18,44.16 31.41,44.16
  Top Layer w0.8: C25.2 45.84,42.86 R69.1 ; 44.81,44.16 44.81,42.92
  Top Layer w1: 88.56,34.21 90.23,34.21 92.76,36.73 92.76,59.49 88.6,63.66 v5(66.24,63.66) ; v5(46.89,46.23) 44.81,44.16 v5(40.61,44.16)
  Top Layer w2: P3.2 86.5,21.55 89.74,24.8 89.74,33.03 87.96,34.8 80.95,34.8 79.76,36 79.76,42.76 Q10.2
  Bottom Layer w0.34: v3(75.84,59.63) 76.53,58.95 v3(76.53,45.34)
  Bottom Layer w0.8: v5(40.61,44.16) 40.61,35.74 35.76,30.89 35.76,28.76 33.5,26.5 30.34,26.5 20,16.16 P10.1
  Bottom Layer w1: v5(66.24,63.66) 55.84,53.25 55.83,53.25 v4(50.02,47.44) 48.1,47.44 v5(46.89,46.23)
P-: length 21.2
  Top Layer w0.254: 41.25,65.89 41.26,65.88 U0.99 ; U0.32 38.76,81.74 39.27,82.25
  Top Layer w0.28: U8.7 98.24,23.01 98.64,22.61 98.64,22.22 98.85,22.01 U8.2
  Top Layer w0.3: 45.24,71.81 44.6,71.17 U0.11 ; 26.44,72.4 26.72,72.67 U0.62 29.03,72.67 29.36,72.34 29.36,71.28 30.23,70.41 30.23,70.13 ; 33.43,68.51 32.72,67.8 32.72,66.05 32.26,65.59 U0.81
  vias: v4(4.45,86.19) v4(12.77,45.81) v4(13.54,23.12) v4(14.91,23.14) v4(20.3,42.14) v4(20.3,40.52) v4(22.12,34.73) v4(22.1,32.62) v4(25.35,71.23) v4(28.6,88.75) v4(30.05,67.57) v4(31.01,73.64) v4(32.59,88.57) v4(36.3,67.66) v4(38.15,61.14) v4(38.23,38.74) v4(38.23,37.25) v4(41.58,56.16) v4(41.9,84.59) v4(46.1,75.27) v4(46.33,73.66) v4(48.97,66.59) v4(50.72,45.19) v4(83.82,3.31) v4(88.61,3.38) v4(88.82,82.89) v4(90.69,83.62) v4(92.24,85.04) v4(99.75,3.89) v4(99.83,6.08) v4(102.19,6.13) v4(102.22,3.87) v4(104.98,89.34)
PB1: length 69.6
  Top Layer w0.254: U0.20 42.49,75.67 41.91,75.09 41.91,74.22 41.5,73.82 v4(40.11,73.82)
  Bottom Layer w0.3: H2.4 16.05,40.52 16.05,74.73 18.11,76.79 32.56,76.79 35.53,73.82 v4(40.11,73.82)
PB1PC: length 67.6
  Top Layer w0.3: H2.3 8.41,35.41 8.41,22.76 12.65,18.52 v4(24.51,18.52)
  Bottom Layer w0.3: CN1.a9 54.24,15.7 34.9,15.7 33.96,16.64 33.96,18.27 33.15,19.08 28.12,19.08 27.56,18.52 v4(24.51,18.52)
PB2: length 67
  Top Layer w0.254: U0.21 42.21,76.17 41.15,75.11 v4(40.11,75.11)
  Bottom Layer w0.3: v4(40.11,75.11) 35.61,75.11 33.2,77.53 17.6,77.53 15.09,75.01 15.09,42.09 H2.6
PB2PC: length 79
  Top Layer w0.3: H2.5 7.54,37.09 7.54,22.43 13.18,16.79 25.83,16.79 26.85,17.81 31.5,17.81 35.79,13.52 59.13,13.52 60.78,15.17 60.78,17.16 CN1.a11
PB3: length 65.1
  Top Layer w0.254: U0.22 41.64,76.67 41.22,76.26 v4(40.74,76.26)
  Bottom Layer w0.3: v4(40.74,76.26) 35.56,76.26 33.53,78.29 17.17,78.29 14.22,75.34 14.22,43.77 H2.8
PB3PC: length 80
  Top Layer w0.3: v4(26.19,15.85) 12.88,15.85 6.71,22.03 6.71,38.79 H2.7
  Bottom Layer w0.3: v4(26.19,15.85) 28.73,18.4 32.56,18.4 33.48,17.48 33.48,16.39 34.92,14.94 56.02,14.94 CN1.a10
RESET: length 150.7
  Top Layer w0.254: v4(17.65,17.63) 25.4,17.63 26.16,18.4 31.75,18.4 35.97,14.18 55.27,14.18 57.07,15.98 57.07,18.47 CN1.b9 ; v4(39.25,77.04) 39.76,77.55 U0.30 39.75,79.88 39.75,81.06 40.23,81.54 41.17,81.54 43.3,83.66 C20.2
  Top Layer w0.3: v4(23.04,80.5) 22,81.54 16.69,81.54 15.04,79.89 15.04,66.27 v4(17.14,64.17) ; R2.1 43.32,84.62 C20.2
  Bottom Layer w0.3: v4(23.04,80.5) 33.12,80.5 36.58,77.04 v4(39.25,77.04) ; v4(17.14,64.17) 17.78,63.53 17.78,37.9 19.51,36.17 19.51,27.44 16.71,24.64 16.71,18.57 v4(17.65,17.63)
SCL: length 156.5
  Top Layer w0.254: v4(24.46,73.08) 24.46,80.98 26.24,82.76 32.54,82.76 33.26,82.04 U0.43
  Top Layer w0.28: U8.5 101.98,23.51 102.59,22.89 102.59,21.09 101.8,20.3 v4(100.84,20.3)
  Top Layer w0.3: v4(30.18,29.14) 30.18,24.44 31.93,22.69 57.61,22.69 58.31,21.98 CN1.b10
  Bottom Layer w0.3: v4(30.18,29.14) 28.27,31.04 28.27,58.83 24.46,62.64 v4(24.46,73.08) ; CN1.b10 59.56,18.52 59.56,16.67 61.09,15.14 74.12,15.14 79.27,20.3 v4(100.84,20.3)
SDA: length 147.8
  Top Layer w0.254: U0.44 32.76,80.86 31.95,81.67 27.94,81.67 26.34,80.07 v4(26.34,73.72)
  Top Layer w0.28: U8.4 101.26,23.01 101.78,22.48 v4(101.78,21.39)
  Top Layer w0.3: CN1.b11 60.85,22.16 59.64,23.37 32.64,23.37 31.72,24.29 v4(31.72,28.05)
  Bottom Layer w0.3: CN1.b11 62.1,18.52 62.1,16.64 63.07,15.68 73.84,15.68 79.55,21.39 v4(101.78,21.39) ; v4(26.34,73.72) 26.34,63.78 30.51,59.62 30.51,32.11 31.72,30.89 v4(31.72,28.05)
SUN1: length 33.7
  Top Layer w0.3: R68.1 40.65,42.02 v4(38.72,42.02) 36.7,42.02 35.21,43.51 U2.13 ; R31.1 48.96,51.35 48.41,51.9 v4(46.63,51.9)
  Top Layer w1: 40.65,35.75 40.65,41.99 R68.1
  Bottom Layer w0.3: v4(38.72,42.02) 38.72,47.82 42.8,51.9 v4(46.63,51.9)
SW0: length 29
  Top Layer w0.254: U0.90 36.76,63.23 v4(36.32,62.79)
  Top Layer w0.3: R25.2 14.56,62.31 v4(30.33,62.31)
  Bottom Layer w0.3: v4(36.32,62.79) 35.84,62.31 v4(30.33,62.31)
SW4: length 68.1
  Top Layer w0.254: U0.94 38.76,62.34 v4(39.24,61.85)
  Top Layer w0.3: v4(52.71,69.53) 59.41,76.23 73.2,76.23 v4(73.89,76.92)
  Bottom Layer w0.3: v4(73.89,76.92) 78.1,81.13 v4(96.5,81.13) ; v4(52.71,69.53) 49.48,69.53 41.81,61.85 v4(39.24,61.85)
U1_3: length 3.3
  Top Layer w1.2: D22.1 84.58,73.57 U1.3
VC1: length 18.6
  Top Layer w0.34: R71.2 73.11,42.8 72.42,43.49 72.42,49.41 71.48,50.35 64.01,50.35 63.32,51.03 62.39,51.03 C71.2
VC2: length 17.4
  Top Layer w0.34: C72.2 66.68,48.94 67.49,49.74 70.94,49.74 71.77,48.91 71.77,43.48 71.16,42.87 R72.2
VC3: length 18.8
  Top Layer w0.34: C73.2 66.85,46.89 67.23,47.27 67.23,48.54 67.87,49.18 70.56,49.18 71.12,48.62 71.12,43.67 70.41,42.96 69.44,42.96 69.1,42.62 R73.2
VC4: length 20.1
  Top Layer w0.34: C74.2 63.78,44.84 64.36,45.42 67.23,45.42 67.83,46.02 67.83,48.2 68.3,48.67 70.1,48.67 70.47,48.31 70.47,44.21 69.82,43.57 67.89,43.57 67,42.67 R74.2
VSOLAR: length 235.7
  Top Layer w0.35: U2.15 31.67,44.81 31.27,45.22 31.27,47.58
  Top Layer w0.6: R61.1 19.32,38.65 18.72,39.25 18.72,46.84 19.32,47.44 C22.1 20.12,53.55 17.81,55.86 D6.1 4.9,56.98 4.32,57.56 4.32,76.23 3.61,76.94 3.61,80.73 D20.1 5,82.25 8.1,85.35 8.1,93.81 14.05,99.75 95.58,99.75 101.4,93.93 101.4,85.73 105.99,81.13 105.99,77.53 D21.1 104.37,63.15 105.22,62.3 105.22,56.6 105.43,56.39 D7.1 ; Q17.2 31.86,48.16 31.27,47.58 L8.1 22.86,47.48 20.4,47.48
VT0: length 68.7
  Top Layer w0.6: CN1.a16 CN1.b16 81.08,19.77 v4(81.89,18.96)
  Bottom Layer w0.6: P5.2 96.23,44.82 96.83,45.42 100.32,45.42 100.97,44.77 100.97,30.21 106.12,25.06 106.12,20.99 104.09,18.96 v4(81.89,18.96)
VT1: length 86.3
  Top Layer w0.6: v4(82.17,17.23) 81.38,17.23 80.06,18.55 77.14,18.55 73.97,15.37 71.68,15.37 71.01,16.04 CN1.a15 CN1.b15
  Bottom Layer w0.6: v4(82.17,17.23) 105.03,17.23 107.24,19.44 107.24,25.67 102.13,30.77 102.13,45.62 101.02,46.74 95.88,46.74 94.06,44.91 94.06,41.66 94.67,41.05 P5.4
VT2: length 100.9
  Top Layer w0.6: CN1.a14 CN1.b14 68.47,20.06 69.72,21.32 82.37,21.32 83.59,20.1 v4(83.59,15.75)
  Bottom Layer w0.6: v4(83.59,15.75) 105.92,15.75 108.28,18.12 108.28,26.24 103.45,31.07 103.45,46.41 101.83,48.04 95.53,48.04 92.89,45.39 92.89,40.05 94.44,38.51 P5.6
VT3: length 47.6
  Top Layer w0.6: v4(77.42,30.97) 78.66,29.72 78.66,22.99 77.88,22.21 67.01,22.21 65.93,21.12 CN1.b13 CN1.a13
  Bottom Layer w0.6: 96.23,35.97 91.97,35.97 89.15,33.15 78.21,33.15 77.42,32.37 v4(77.42,30.97)
VT4: length 45.6
  Top Layer w0.6: v4(77.5,28.48) 77.47,28.45 77.47,23.67 76.87,23.07 64.47,23.07 63.39,21.99 CN1.b12 CN1.a12
  Bottom Layer w0.6: v4(77.5,28.48) 77.5,29.22 78.64,30.36 88.6,30.36 91.66,33.43 P5.10
XTAL1: length 16.6
  Top Layer w0.3: C1.2 31.65,88.85 32.4,89.6 R1.1 ; U0.34 37.76,82.16 36.5,83.42 35.36,83.42 34.04,84.74 Y1.1 34.03,85.88 31.66,85.88
XTAL2: length 12.4
  Top Layer w0.254: U0.33 38.26,82.18 38.61,82.53 C2.2
  Top Layer w0.3: 38.62,87.64 38.61,87.63 Y1.3 36.24,88.43 35.92,88.75 R1.2

## Copper pours and planes (outline as drawn; the poured copper is in the pictures)
AGND on Top Layer: 28.51,23.26 28.58,23.19 28.58,20.73 32.79,20.73 32.82,20.76 32.82,22.1 32.87,22.15 31.91,22.15 30.78,23.25 28.7,23.25 28.65,23.2 28.59,23.26
AGND on Top Layer: 14.6,13.81 25.42,13.81 25.42,4.41 14.6,4.41
AGND on Top Layer: 28.54,23.28 30.63,23.28 30.63,20.48 28.54,20.48
AGND on Top Layer: 56.97,36.45 57.51,35.92 89.89,35.92 91.16,37.19 91.16,59.49 88.16,62.49 61.11,62.49 56.97,58.35
AGND on Top Layer: 42.7,16.31 41.95,17.06 41.95,20.17 41.34,20.78 33.38,20.78 33.1,20.5 30.45,20.5 30,20.96 30,22.23 45.87,22.23 46.61,21.49 46.61,16.92 46,16.31
AGND on Bottom Layer: 53.8,44.36 57.23,46.93 57.23,42.32 57.15,42.25 54.5,43.92
AGND on Bottom Layer: 56.95,54.31 56.95,36.48 57.51,35.92 89.41,35.92 91.16,37.67 91.16,59.49 88.16,62.49 65.13,62.49
AGND on Bottom Layer: 90.7,52.58 93.05,52.58 93.05,47.91 90.7,47.91
AGND on Bottom Layer: 41.96,20.05 42.77,20.86 45.87,20.86 46.61,20.12 46.61,16.92 46,16.31 42.7,16.31 41.96,17.05
AGND on Bottom Layer: 14.67,13.81 25.47,13.81 25.47,4.43 14.67,4.43
V12V on Bottom Layer: 47.24,20.15 47.78,20.68 51.1,20.68 51.69,20.09 51.69,16.77 51.13,16.21 47.96,16.21 47.24,16.92
B1 on Top Layer: 61.06,91.47 61.06,94.65 61.72,95.31 86.82,95.31 87.73,94.39 87.73,91.72 86.9,90.89 61.65,90.89
B2 on Top Layer: 40.89,28.68 47.45,28.68 49.33,26.8 58.7,26.8 61.54,29.65 69.11,29.65 69.77,28.99 69.77,25.63 68.4,24.26 40.67,24.26 40,24.93 40,27.79
B3 on Top Layer: 21.49,91.57 21.49,94.52 22.28,95.31 47.4,95.31 48.13,94.57 48.13,91.7 47.37,90.94 22.12,90.94
B+ on Top Layer: 78.69,56.44 78.92,56.22 81.84,56.22 82.12,56.5 82.12,58.12 82.37,58.37 84.86,58.37 85.12,58.12 85.12,56.44 85.34,56.22 88.28,56.22 88.53,56.47 88.53,59.85 87.72,60.67 79.51,60.67 78.69,59.85
B+ on Top Layer: 20.95,28.56 20.97,28.67 21.02,28.8 21.1,28.92 21.22,29 21.35,29.05 21.45,29.06 29.02,29.06 29.12,29.05 29.25,29 29.37,28.92 29.45,28.8 29.5,28.67 29.52,28.56 29.52,25.85 29.5,25.75 29.45,25.61 29.37,25.5 29.25,25.42 29.12,25.37 29.02,25.35 21.45,25.35 21.35,25.37 21.22,25.42 21.1,25.5 21.02,25.61 20.97,25.75 20.95,25.85
B- on Top Layer: 79.43,28.59 79.44,28.69 79.49,28.83 79.57,28.94 79.69,29.03 79.82,29.08 79.93,29.09 87.44,29.09 87.54,29.08 87.67,29.03 87.79,28.94 87.87,28.83 87.92,28.69 87.94,28.59 87.94,25.75 87.92,25.65 87.87,25.51 87.79,25.4 87.67,25.31 87.54,25.26 87.44,25.25 79.93,25.25 79.82,25.26 79.69,25.31 79.57,25.4 79.49,25.51 79.44,25.65 79.43,25.75
N1 on Top Layer: 0.18,75.22 0.19,75.33 0.24,75.46 0.32,75.58 0.44,75.66 0.57,75.71 0.68,75.72 3.95,75.72 4.06,75.71 4.19,75.66 4.31,75.58 4.39,75.46 4.44,75.33 4.45,75.22 4.45,46.17 4.44,46.06 4.39,45.93 4.31,45.81 4.19,45.73 4.06,45.68 3.95,45.67 0.68,45.67 0.57,45.68 0.44,45.73 0.32,45.81 0.24,45.93 0.19,46.06 0.18,46.17
N2 on Top Layer: 104.17,76.27 104.18,76.37 104.23,76.51 104.31,76.62 104.43,76.71 104.56,76.76 104.67,76.77 108.42,76.77 108.53,76.76 108.66,76.71 108.78,76.62 108.86,76.51 108.91,76.37 108.92,76.27 108.92,46.47 108.91,46.36 108.86,46.23 108.78,46.12 108.66,46.03 108.53,45.98 108.42,45.97 104.67,45.97 104.56,45.98 104.43,46.03 104.31,46.12 104.23,46.23 104.18,46.36 104.17,46.47
NETQ10_5 on Top Layer: 77.31,52.64 77.74,53.06 88.23,53.06 88.65,52.64 88.65,48.01 88.22,47.59 77.74,47.59 77.31,48.01 77.31,52.64
P+ on Top Layer: 77.32,42.72 77.32,45.57 78.1,46.36 86.64,46.36 87.27,45.73 87.27,42.58 87.05,42.35 84.07,42.35 83.74,42.68 83.74,44.46 83.59,44.61 81.03,44.61 80.85,44.43 80.85,42.6 80.59,42.35 77.69,42.35
P- on Top Layer: 0.03,101.15 111.48,101.15 111.48,-0.99 0.03,-0.99
P- on Bottom Layer: -0.71,101.43 109.88,101.43 109.88,-0.35 -0.71,-0.35

Small or netless copper shapes (teardrops, artwork), in the pictures only: 349 on Top Layer, 97 on Bottom Layer

## Text on the board
Bottom Silkscreen Layer: 1 | 2 | 3 | 4 | 5 | + | EPS Card | 太阳能1 | 太阳能2 | 太阳能3 | 太阳能4 | ON/OFF | ICSP跳线 | 热控通道 | 充电
Top Silkscreen Layer: >1000000 | + | AstroStorm V2.0 | EPS Card | 电池加热 | LOW | CPU | AS-BUS
